# Altium schematic sheet MKE1xFxxxVLH.SchDoc
size A
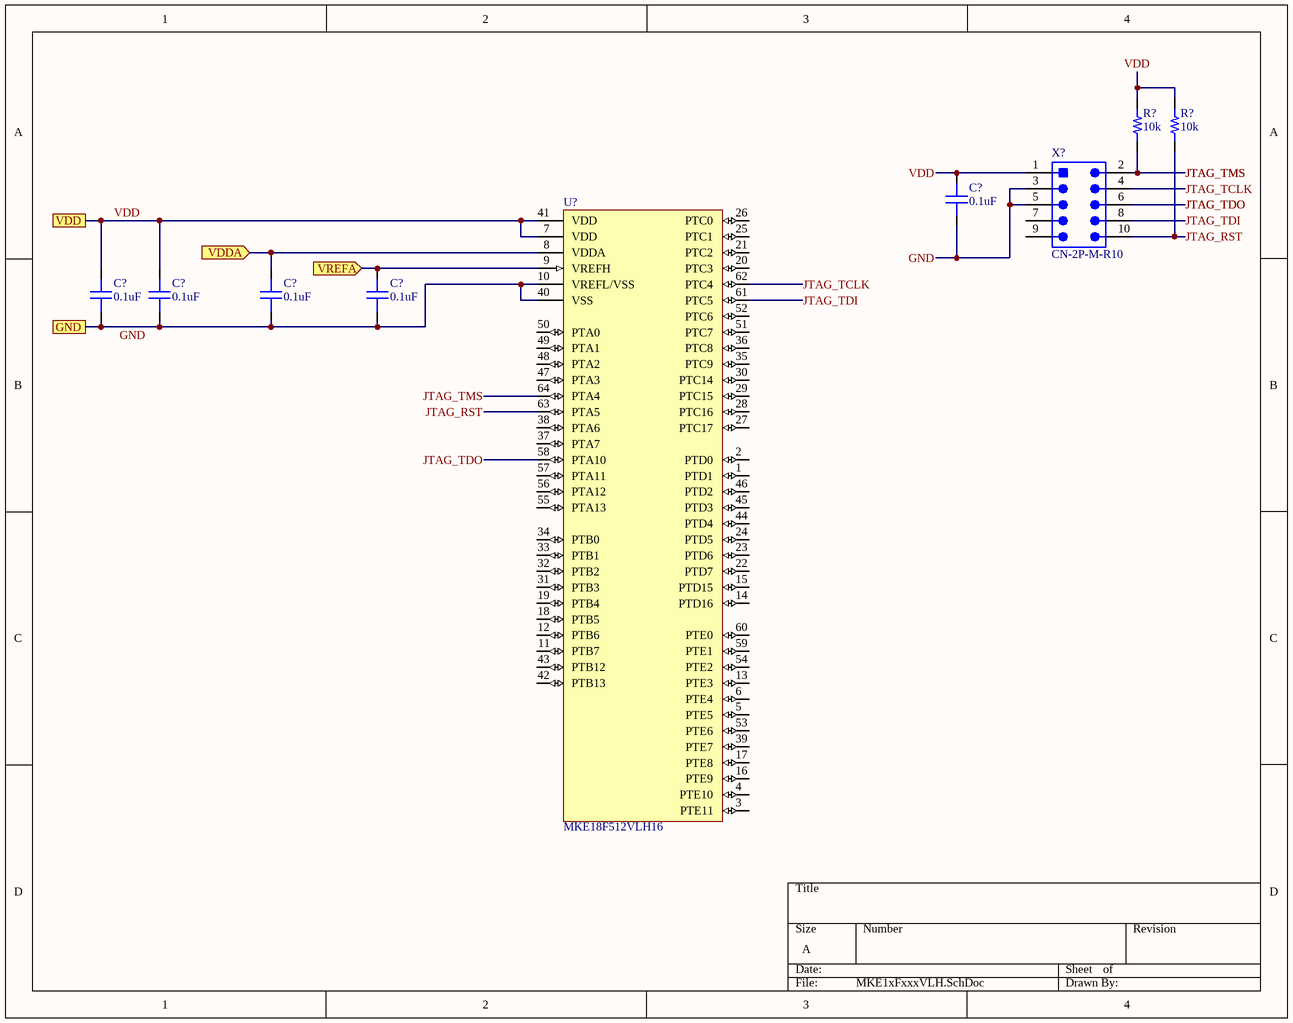
[diagram p0: MKE1xFxxxVLH.SchDoc]

## Parts
(Parts that share a designator on the sheet are numbered #1, #2 ... from top to bottom, then left to right.)
C?#1  capacitance: 0.1uF  [0603]  (hidden comment: capacitor)
C?#2  capacitance: 0.1uF  [0603]  (hidden comment: capacitor)
C?#3  capacitance: 0.1uF  [0603]  (hidden comment: capacitor)
C?#4  capacitance: 0.1uF  [0603]  (hidden comment: capacitor)
C?#5  capacitance: 0.1uF  [0603]  (hidden comment: capacitor)
R?#1  resistance: 10k  [0603]  (hidden comment: resistor)
R?#2  resistance: 10k  [0603]  (hidden comment: resistor)
U?  MKE18F512VLH16  [TQFP64]
X?  CN-2P-M-R10  [HDR2X5_SMT]

## Ports
GND, VDD, VDDA (in), VREFA (in)

## Nets
GND: C?#1.1 C?#2.1 C?#3.1 C?#4.1 C?#5.1 U?.10(VREFL/VSS) U?.40(VSS) X?.3 X?.5 ; port GND
JTAG_RST: R?#2.1 U?.63(PTA5) X?.10
JTAG_TCLK: U?.62(PTC4) X?.4
JTAG_TDI: U?.61(PTC5) X?.8
JTAG_TDO: U?.58(PTA10) X?.6
JTAG_TMS: R?#1.1 U?.64(PTA4) X?.2
VDD: C?#1.2 C?#2.2 C?#3.2 R?#1.2 R?#2.2 U?.7(VDD) U?.41(VDD) X?.1 ; port VDD
VDDA: C?#4.2 U?.8(VDDA) ; port VDDA
VREFA: C?#5.2 U?.9(VREFH) ; port VREFA

Not connected (* = marked no-connect by the designer): U? 1(PTD1) 2(PTD0) 3(PTE11) 4(PTE10) 5(PTE5) 6(PTE4) 11(PTB7) 12(PTB6) 13(PTE3) 14(PTD16) 15(PTD15) 16(PTE9) 17(PTE8) 18(PTB5) 19(PTB4) 20(PTC3) 21(PTC2) 22(PTD7) 23(PTD6) 24(PTD5) 25(PTC1) 26(PTC0) 27(PTC17) 28(PTC16) 29(PTC15) 30(PTC14) 31(PTB3) 32(PTB2) 33(PTB1) 34(PTB0) 35(PTC9) 36(PTC8) 37(PTA7) 38(PTA6) 39(PTE7) 42(PTB13) 43(PTB12) 44(PTD4) 45(PTD3) 46(PTD2) 47(PTA3) 48(PTA2) 49(PTA1) 50(PTA0) 51(PTC7) 52(PTC6) 53(PTE6) 54(PTE2) 55(PTA13) 56(PTA12) 57(PTA11) 59(PTE1) 60(PTE0); X? 7 9

## Library data of the parts
C?#1-C?#5 = 1: Generic 0603 capacitor; id: 1; voltage: 50; dielectric: Ceramic; percent tolerance: 10; Name: 0603 Capacitor; ESR: 1; package: 0603; quantity: 0
R?#1 R?#2 = 1: id: 1; Name: 0603 Resistor; percent tolerance: 5; package: 0603; quantity: 0
U? = 1: 32b NXP Microcontroller; id: 1; voltagemin: 2.70000004768372; voltagemax: 5.5; name: MKE18F512VLH16; package: TQFP64; quantity: 0
X? = 4: CONN_TE_2X5POS; id: 4; Name: 5103309-1; numcontacts: 10; numrows: 2; pitch: 2.54mm; MfrPartNo: *; link: https://www.digikey.com/product-detail/en/5103309-1/A33160-ND/1114898?utm_campaign=buynow&WT.z_cid=ref_octopart_dkc_buynow&utm_medium=aggregator&curr=usd&site=us&utm_source=octopart; quantity: 0